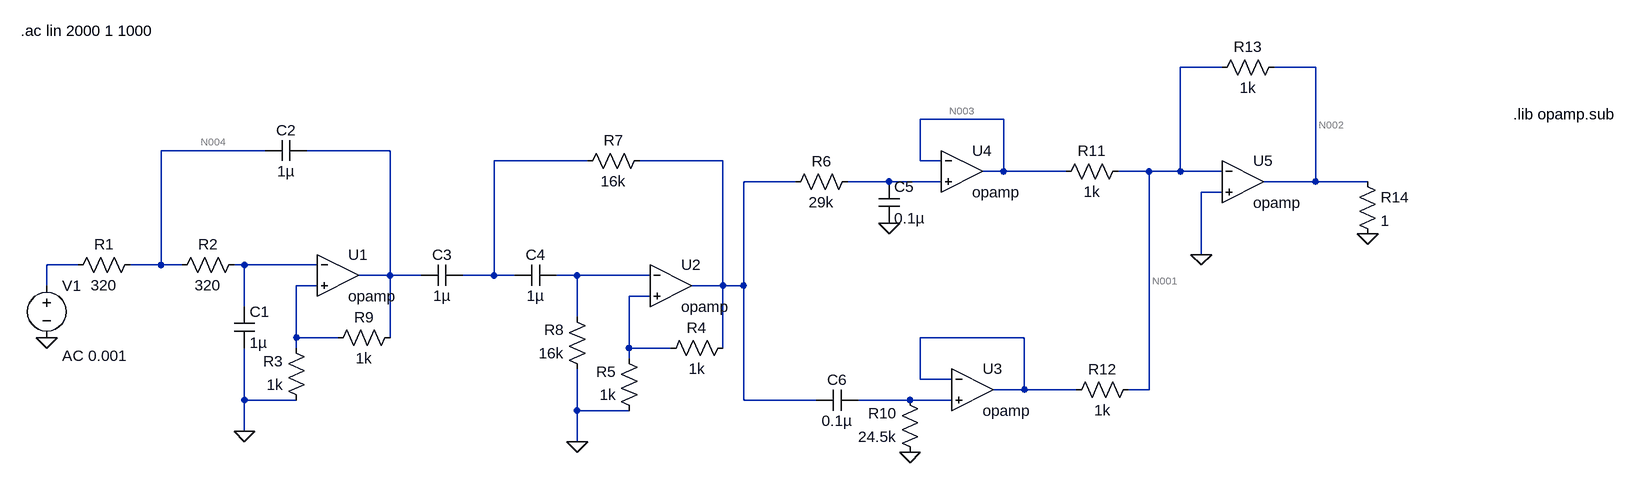
[diagram p0: schematic AllFilters.asc]
AllFilters.asc, the LTspice schematic file:
Version 4
SHEET 1 1996 680
WIRE 1376 -192 1312 -192
WIRE 1520 -192 1456 -192
WIRE 1040 -112 912 -112
WIRE -96 -64 -256 -64
WIRE 96 -64 -32 -64
WIRE 400 -48 256 -48
WIRE 608 -48 480 -48
WIRE 912 -48 912 -112
WIRE 944 -48 912 -48
WIRE 1040 -32 1040 -112
WIRE 1040 -32 1008 -32
WIRE 1136 -32 1040 -32
WIRE 1264 -32 1216 -32
WIRE 1312 -32 1312 -192
WIRE 1312 -32 1264 -32
WIRE 1376 -32 1312 -32
WIRE 720 -16 640 -16
WIRE 864 -16 800 -16
WIRE 944 -16 864 -16
WIRE 1520 -16 1520 -192
WIRE 1520 -16 1440 -16
WIRE 1600 -16 1520 -16
WIRE 1376 0 1344 0
WIRE 1344 96 1344 0
WIRE -384 112 -432 112
WIRE -256 112 -256 -64
WIRE -256 112 -304 112
WIRE -224 112 -256 112
WIRE -128 112 -144 112
WIRE -16 112 -128 112
WIRE 96 128 96 -64
WIRE 96 128 48 128
WIRE 144 128 96 128
WIRE 256 128 256 -48
WIRE 256 128 208 128
WIRE 288 128 256 128
WIRE 384 128 352 128
WIRE 496 128 384 128
WIRE -432 144 -432 112
WIRE -16 144 -48 144
WIRE 608 144 608 -48
WIRE 608 144 560 144
WIRE 640 144 640 -16
WIRE 640 144 608 144
WIRE 496 160 464 160
WIRE -128 176 -128 112
WIRE 384 192 384 128
WIRE -48 224 -48 144
WIRE 16 224 -48 224
WIRE 96 224 96 128
WIRE 1072 224 912 224
WIRE -48 240 -48 224
WIRE 464 240 464 160
WIRE 528 240 464 240
WIRE 608 240 608 144
WIRE 464 256 464 240
WIRE 912 288 912 224
WIRE 960 288 912 288
WIRE 1072 304 1072 224
WIRE 1072 304 1024 304
WIRE 1152 304 1072 304
WIRE 1264 304 1264 -32
WIRE 1264 304 1232 304
WIRE -128 320 -128 240
WIRE -48 320 -128 320
WIRE 640 320 640 144
WIRE 752 320 640 320
WIRE 896 320 816 320
WIRE 960 320 896 320
WIRE 384 336 384 272
WIRE 464 336 384 336
WIRE -128 368 -128 320
WIRE 384 384 384 336
FLAG -128 368 0
FLAG -432 224 0
FLAG 384 384 0
FLAG 1600 64 0
FLAG 1344 96 0
FLAG 896 400 0
FLAG 864 48 0
SYMBOL OpAmps\\opamp 16 64 R0
SYMATTR InstName U1
SYMBOL voltage -432 128 R0
WINDOW 123 24 124 Left 2
WINDOW 39 0 0 Left 0
SYMATTR Value2 AC 0.001
SYMATTR InstName V1
SYMATTR Value ""
SYMBOL res -288 96 R90
WINDOW 0 0 56 VBottom 2
WINDOW 3 32 56 VTop 2
SYMATTR InstName R1
SYMATTR Value 320
SYMBOL res -128 96 R90
WINDOW 0 0 56 VBottom 2
WINDOW 3 32 56 VTop 2
SYMATTR InstName R2
SYMATTR Value 320
SYMBOL cap -144 176 R0
SYMATTR InstName C1
SYMATTR Value 1µ
SYMBOL cap -32 -80 R90
WINDOW 0 0 32 VBottom 2
WINDOW 3 32 32 VTop 2
SYMATTR InstName C2
SYMATTR Value 1µ
SYMBOL res -32 336 R180
WINDOW 0 36 76 Left 2
WINDOW 3 36 40 Left 2
SYMATTR InstName R3
SYMATTR Value 1k
SYMBOL OpAmps\\opamp 528 80 R0
SYMATTR InstName U2
SYMBOL res 624 224 R90
WINDOW 0 0 56 VBottom 2
WINDOW 3 32 56 VTop 2
SYMATTR InstName R4
SYMATTR Value 1k
SYMBOL res 480 352 R180
WINDOW 0 36 76 Left 2
WINDOW 3 36 40 Left 2
SYMATTR InstName R5
SYMATTR Value 1k
SYMBOL cap 208 112 R90
WINDOW 0 0 32 VBottom 2
WINDOW 3 32 32 VTop 2
SYMATTR InstName C3
SYMATTR Value 1µ
SYMBOL cap 352 112 R90
WINDOW 0 0 32 VBottom 2
WINDOW 3 32 32 VTop 2
SYMATTR InstName C4
SYMATTR Value 1µ
SYMBOL res 496 -64 R90
WINDOW 0 0 56 VBottom 2
WINDOW 3 32 56 VTop 2
SYMATTR InstName R7
SYMATTR Value 16k
SYMBOL res 400 288 R180
WINDOW 0 36 76 Left 2
WINDOW 3 36 40 Left 2
SYMATTR InstName R8
SYMATTR Value 16k
SYMBOL res 112 208 R90
WINDOW 0 0 56 VBottom 2
WINDOW 3 32 56 VTop 2
SYMATTR InstName R9
SYMATTR Value 1k
SYMBOL res 816 -32 R90
WINDOW 0 0 56 VBottom 2
WINDOW 3 32 56 VTop 2
SYMATTR InstName R6
SYMATTR Value 29k
SYMBOL res 912 416 R180
WINDOW 0 36 76 Left 2
WINDOW 3 36 40 Left 2
SYMATTR InstName R10
SYMATTR Value 24.5k
SYMBOL OpAmps\\opamp 992 240 R0
SYMATTR InstName U3
SYMBOL OpAmps\\opamp 976 -96 R0
SYMATTR InstName U4
SYMBOL res 1232 -48 R90
WINDOW 0 0 56 VBottom 2
WINDOW 3 32 56 VTop 2
SYMATTR InstName R11
SYMATTR Value 1k
SYMBOL res 1248 288 R90
WINDOW 0 0 56 VBottom 2
WINDOW 3 32 56 VTop 2
SYMATTR InstName R12
SYMATTR Value 1k
SYMBOL OpAmps\\opamp 1408 -80 R0
SYMATTR InstName U5
SYMBOL res 1472 -208 R90
WINDOW 0 0 56 VBottom 2
WINDOW 3 32 56 VTop 2
SYMATTR InstName R13
SYMATTR Value 1k
SYMBOL res 1584 -32 R0
SYMATTR InstName R14
SYMATTR Value 1
SYMBOL cap 848 -16 R0
SYMATTR InstName C5
SYMATTR Value 0.1µ
SYMBOL cap 816 304 R90
WINDOW 0 0 32 VBottom 2
WINDOW 3 32 32 VTop 2
SYMATTR InstName C6
SYMATTR Value 0.1µ
TEXT 1824 -120 Left 2 !.lib opamp.sub
TEXT -472 -248 Left 2 !.ac lin 2000 1 1000

The netlist it stands for:
* AllFilters.asc
XU1 N010 N012 N005 opamp Aol=100K GBW=10Meg  ; pins invin noninvin out
V1 N009 0 AC 0.001
R1 N004 N009 320
R2 N010 N004 320
C1 N010 0 1µ
C2 N005 N004 1µ
R3 0 N012 1k
XU2 N011 N013 N007 opamp Aol=100K GBW=10Meg  ; pins invin noninvin out
R4 N007 N013 1k
R5 0 N013 1k
C3 N006 N005 1µ
C4 N011 N006 1µ
R7 N007 N006 16k
R8 0 N011 16k
R9 N005 N012 1k
R6 N008 N007 29k
R10 0 N015 24.5k
XU3 N014 N015 N014 opamp Aol=100K GBW=10Meg  ; pins invin noninvin out
XU4 N003 N008 N003 opamp Aol=100K GBW=10Meg  ; pins invin noninvin out
R11 N001 N003 1k
R12 N001 N014 1k
XU5 N001 0 N002 opamp Aol=100K GBW=10Meg  ; pins invin noninvin out
R13 N002 N001 1k
R14 N002 0 1
C5 N008 0 0.1µ
C6 N015 N007 0.1µ
.lib opamp.sub
.ac lin 2000 1 1000
.backanno
.end

* Results of the author's LTspice run, read from the files saved beside the schematic
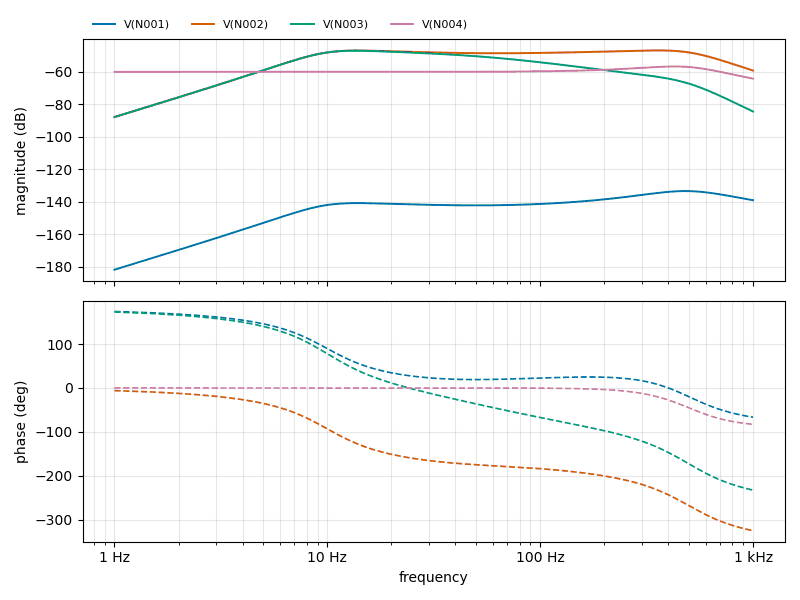
[diagram p1: AC Analysis of AllFilters.asc, plotted from the saved traces]
* AC Analysis, 1 run:
*   V(N001): -181.80 dB at 1 Hz, -139.03 dB at 1 kHz, peak -133.39 dB at 480.3 Hz, 3 dB below the peak at 275.2 Hz and 774.6 Hz
*   V(N002): -87.82 dB at 1 Hz, -59.21 dB at 1 kHz, peak -46.78 dB at 355.8 Hz, 3 dB below the peak at 8.499 Hz and 583.3 Hz
*   V(N003): -87.82 dB at 1 Hz, -84.42 dB at 1 kHz, peak -46.97 dB at 13.49 Hz, 3 dB below the peak at 8.415 Hz and 45.38 Hz
*   V(N004): -60.00 dB at 1 Hz, -64.21 dB at 1 kHz, peak -56.67 dB at 425.8 Hz, 3 dB below the peak at 96.92 Hz and 683.9 Hz